# Altium schematic sheet CRUVI-GT.SchDoc: CRUVI
size A4; PageSetup: Record=PageOptions|CenterHorizontal=True|CenterVertical=True|PrintScale=1.39|XCorrection=1.00|YCorrection=1.00|PrintKind=0|BorderSize=5000000|LeftOffset=0|BottomOffset=0|Orientation=2|PaperLength=1000|PaperWidth=1000|Scale=100|PaperSource=15|PrintQuality=1200|MediaType=1|DitherType=10|PrintScaleMode=1|PaperKind=A3; Organization: MicroFPGA UG; DocumentNumber: CR00111; Revision: 01; SheetNumber: 3; SheetTotal: 6; Date: 2022-05-18; CheckedBy: VT; Author: AL; CompanyName: Trenz Elecronic GmbH; DrawnBy: AL/VT
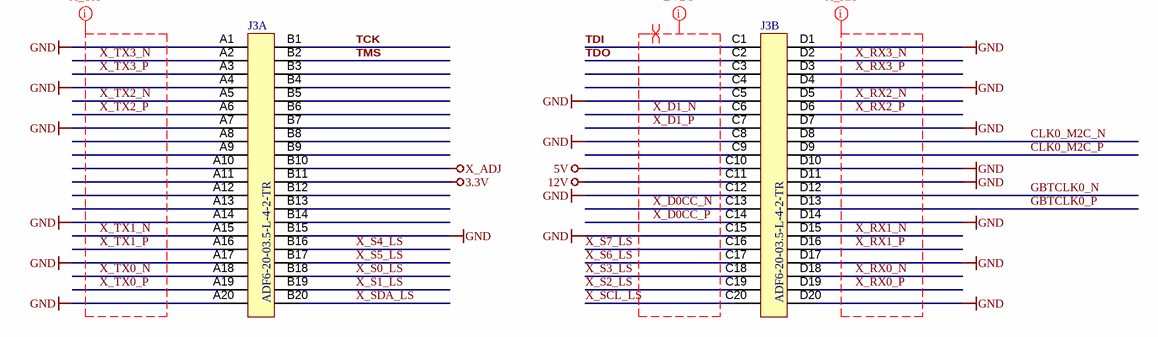
[diagram p0: CRUVI-GT.SchDoc]

## Parts
J3  ADF6-20-03.5-L-4-2-TR  [ADF6-20-03.5-L-4-2]  (parts A,B of 2)

## Nets
3.3V: J3.B11
5V: J3.C10
12V: J3.C11
GND: J3.A1 J3.A4 J3.A7 J3.A14 J3.A17 J3.A20 J3.B15 J3.C5 J3.C8 J3.C12 J3.C15 J3.D1 J3.D4 J3.D7 J3.D10 J3.D11 J3.D14 J3.D17 J3.D20
X_ADJ: J3.B10
CLK0_M2C_N: J3.D8
CLK0_M2C_P: J3.D9
GBTCLK0_N: J3.D12
GBTCLK0_P: J3.D13
TCK: J3.B1
TDI: J3.C1
TDO: J3.C2
TMS: J3.B2
X_D0CC_N: J3.C13
X_D0CC_P: J3.C14
X_D1_N: J3.C6
X_D1_P: J3.C7
X_RX0_N: J3.D18
X_RX0_P: J3.D19
X_RX1_N: J3.D15
X_RX1_P: J3.D16
X_RX2_N: J3.D5
X_RX2_P: J3.D6
X_RX3_N: J3.D2
X_RX3_P: J3.D3
X_S0_LS: J3.B18
X_S1_LS: J3.B19
X_S2_LS: J3.C19
X_S3_LS: J3.C18
X_S4_LS: J3.B16
X_S5_LS: J3.B17
X_S6_LS: J3.C17
X_S7_LS: J3.C16
X_SCL_LS: J3.C20
X_SDA_LS: J3.B20
X_TX0_N: J3.A18
X_TX0_P: J3.A19
X_TX1_N: J3.A15
X_TX1_P: J3.A16
X_TX2_N: J3.A5
X_TX2_P: J3.A6
X_TX3_N: J3.A2
X_TX3_P: J3.A3

Not connected (* = marked no-connect by the designer): J3 A8 A9 A10 A11 A12 A13 B3 B4 B5 B6 B7 B8 B9 B12 B13 B14 C3 C4 C9

## Layout directives
net class X_TX: X_TX0_N, X_TX0_P, X_TX1_N, X_TX1_P, X_TX2_N, X_TX2_P, X_TX3_N, X_TX3_P
net class X_RX: X_RX0_N, X_RX0_P, X_RX1_N, X_RX1_P, X_RX2_N, X_RX2_P, X_RX3_N, X_RX3_P
differential pair: X_D0CC_N, X_D0CC_P, X_D1_N, X_D1_P
net class LVDS: X_D0CC_N, X_D0CC_P, X_D1_N, X_D1_P

## Notes on the sheet
- Title:
- Number:
- Rev.
- Date:
- A4
- Copyright:
- Page
- of
- Drawn by:
- Filename:

## Library data of the parts
J3 = 33973: AN: 33973; Voltage: 155 VAC; Mixed: SMT; Value: 1.4 A per pin (4); Temperature-Range: -55/+125 (Abs); Extra: Samtec 0.635 mm AcceleRate® HD High-Density 4-Row 80 Pin Socket; Case: ADF6; HelpURL: b:\AD\adlib\datasheet\Samtec\ADF6\; H-ART: ADF6-20-03.5-L-4-2-TR